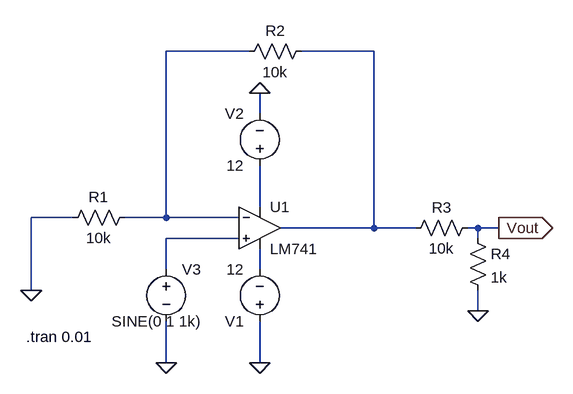
[diagram p0: schematic Draft1.asc]
Draft1.asc, the LTspice schematic file:
Version 4
SHEET 1 1384 680
WIRE 224 -176 96 -176
WIRE 416 -176 304 -176
WIRE 240 -80 240 -112
WIRE 240 64 240 0
WIRE -48 80 -112 80
WIRE 96 80 96 -176
WIRE 96 80 32 80
WIRE 208 80 96 80
WIRE 416 96 416 -176
WIRE 416 96 272 96
WIRE 480 96 416 96
WIRE 576 96 560 96
WIRE 608 96 576 96
WIRE 208 112 96 112
WIRE 576 112 576 96
WIRE 96 160 96 112
WIRE 240 160 240 128
WIRE -112 192 -112 80
WIRE 576 224 576 192
WIRE 96 304 96 240
WIRE 240 304 240 240
FLAG 96 304 0
FLAG 240 304 0
FLAG -112 192 0
FLAG 240 -112 0
FLAG 608 96 Vout
IOPIN 608 96 Out
FLAG 576 224 0
SYMBOL OpAmps\\LM741 240 32 R0
SYMATTR InstName U1
SYMBOL res 48 64 R90
WINDOW 0 0 56 VBottom 2
WINDOW 3 32 56 VTop 2
SYMATTR InstName R1
SYMATTR Value 10k
SYMBOL voltage 240 256 R180
WINDOW 123 0 0 Left 0
WINDOW 39 0 0 Left 0
SYMATTR InstName V1
SYMATTR Value 12
SYMBOL voltage 240 16 R180
WINDOW 0 24 96 Left 2
WINDOW 3 24 16 Left 2
WINDOW 123 0 0 Left 0
WINDOW 39 0 0 Left 0
SYMATTR InstName V2
SYMATTR Value 12
SYMBOL voltage 96 144 R0
WINDOW 123 0 0 Left 0
WINDOW 39 0 0 Left 0
WINDOW 3 -84 96 Left 2
SYMATTR InstName V3
SYMATTR Value SINE(0 1 1k)
SYMBOL res 320 -192 R90
WINDOW 0 0 56 VBottom 2
WINDOW 3 32 56 VTop 2
SYMATTR InstName R2
SYMATTR Value 10k
SYMBOL res 576 80 R90
WINDOW 0 0 56 VBottom 2
WINDOW 3 32 56 VTop 2
SYMATTR InstName R3
SYMATTR Value 10k
SYMBOL res 560 96 R0
SYMATTR InstName R4
SYMATTR Value 1k
TEXT -120 264 Left 2 !.tran 0.01

The netlist it stands for:
* Draft1.asc
XU1 N004 N001 N003 N005 N002 LM741  ; pins In+ In- V+ V- OUT
R1 N001 0 10k
V1 0 N005 12
V2 N003 0 12
V3 N004 0 SINE(0 1 1k)
R2 N002 N001 10k
R3 Vout N002 10k
R4 Vout 0 1k
.tran 0.01
.lib LM741.lib
.backanno
.end